# EasyEDA schematic 1-Schematic_BCD to Seven Seg.json
TITLE: Seven Sex Converter; REV: 2; Date: 2022-03-27; Sheet: 1/1; Drawn By: Samuel Raumin; Company: your mom
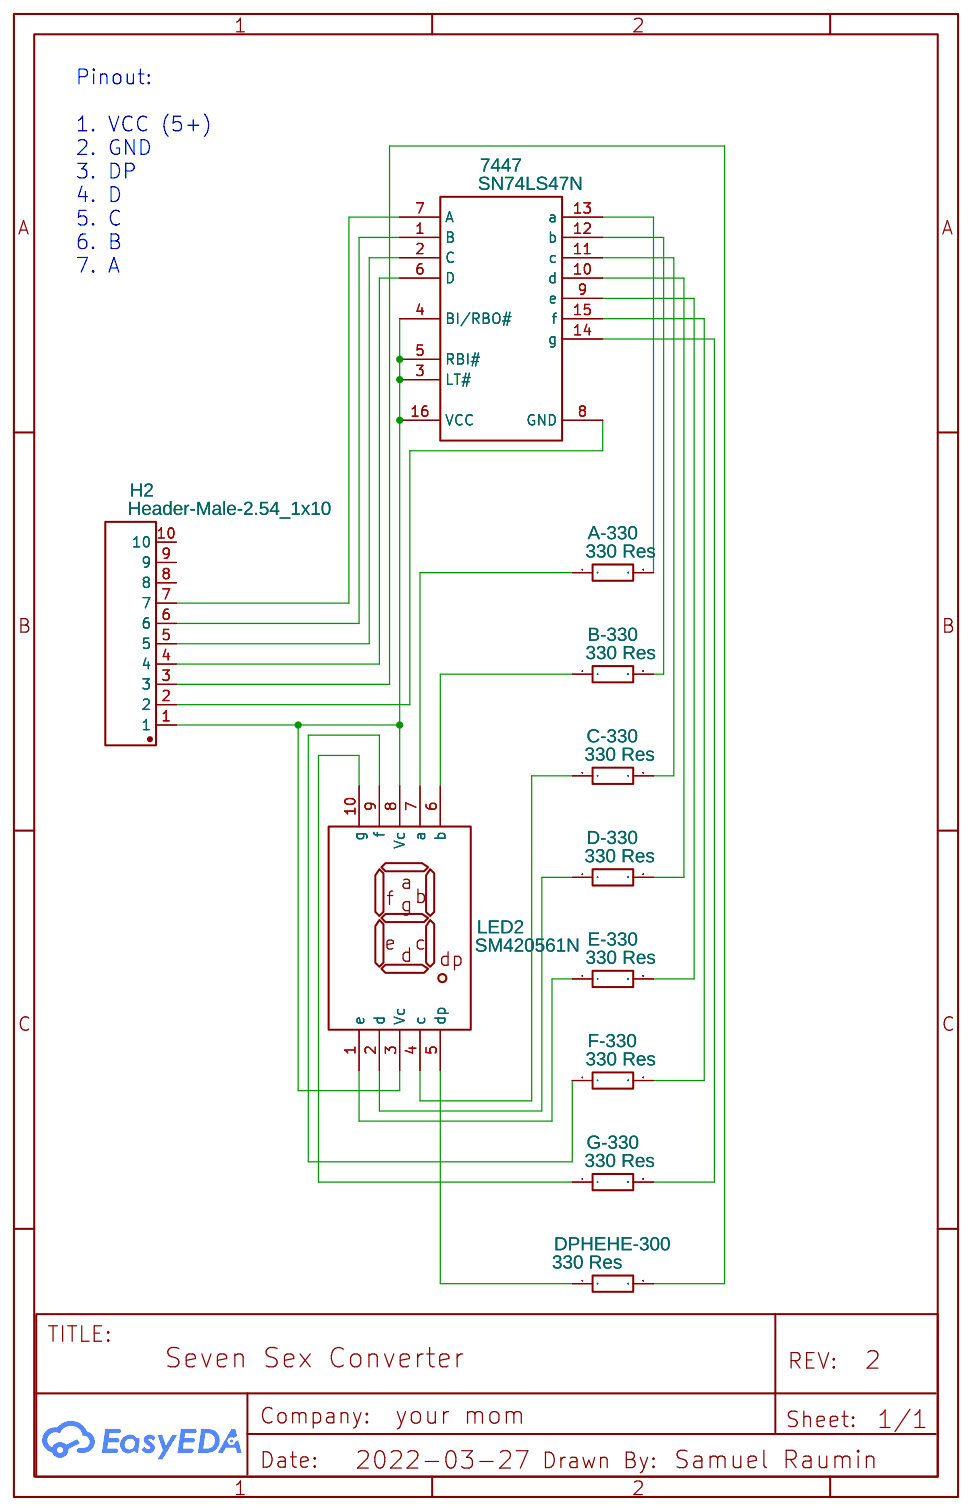
[diagram p0: schematic sheet]

## Parts
7447  SN74LS47N  [DIP-16_L19.3-W6.4-P2.54-LS7.6-BL]
A-330  330 Res  [RES-TH_BD2.5-L6.2-P10.20-D0.6]
B-330  330 Res  [RES-TH_BD2.5-L6.2-P10.20-D0.6]
C-330  330 Res  [RES-TH_BD2.5-L6.2-P10.20-D0.6]
D-330  330 Res  [RES-TH_BD2.5-L6.2-P10.20-D0.6]
DPHEHE-300  330 Res  [RES-TH_BD2.5-L6.2-P10.20-D0.6]
E-330  330 Res  [RES-TH_BD2.5-L6.2-P10.20-D0.6]
F-330  330 Res  [RES-TH_BD2.5-L6.2-P10.20-D0.6]
G-330  330 Res  [RES-TH_BD2.5-L6.2-P10.20-D0.6]
H2  Header-Male-2.54_1x10  [HDR-TH_10P-P2.54-V-M-1]
LED2  SM420561N  [LED-SEG-TH_10P-L12.7-W19.0-P2.54-S15.24-BL]

## Library data of the parts
7447 = SN74LS47N: Supplier: LCSC; Manufacturer: TI; Contributor: LCSC; Supplier Part: C129379; JLCPCB Part Class: Extended Part
A-330 B-330 C-330 D-330 DPHEHE-300 E-330 F-330 G-330 = FR1/4W-10Ω±5%: Supplier: LCSC; Supplier Part: C138368; Manufacturer: Chian Chia Elec; Contributor: LCSC; JLCPCB Part Class: Extended Part; Resistance: 10Ω
H2 = Header-Male-2.54_1x10: Supplier: LCSC; Manufacturer Part: Headers  Pins2.54mm1*10P; Supplier Part: C57369; JLCPCB Part Class: Extended Part
LED2 = SM420561N: Supplier: LCSC; Manufacturer: ARKLED; Contributor: LCSC; Supplier Part: C141367; JLCPCB Part Class: Extended Part

## Nets
Net-(7447-1): 7447.1(B) H2.6
Net-(7447-2): 7447.2(C) H2.5
Net-(7447-3): 7447.3(LT#) 7447.4(BI/RBO#) 7447.5(RBI#) 7447.16(VCC) H2.1 LED2.3(Vc) LED2.8(Vc)
Net-(7447-6): 7447.6(D) H2.4
Net-(7447-7): 7447.7(A) H2.7
Net-(7447-8): 7447.8(GND) H2.2
Net-(7447-9): 7447.9(e) E-330.2
Net-(7447-10): 7447.10(d) D-330.2
Net-(7447-11): 7447.11(c) C-330.2
Net-(7447-12): 7447.12(b) B-330.2
Net-(7447-13): 7447.13(a) A-330.2
Net-(7447-14): 7447.14(g) G-330.2
Net-(7447-15): 7447.15(f) F-330.2
Net-(A-330-1): A-330.1 LED2.7(a)
Net-(B-330-1): B-330.1 LED2.6(b)
Net-(C-330-1): C-330.1 LED2.4(c)
Net-(D-330-1): D-330.1 LED2.2(d)
Net-(DPHEHE-300-1): DPHEHE-300.1 LED2.5(dp)
Net-(DPHEHE-300-2): DPHEHE-300.2 H2.3
Net-(E-330-1): E-330.1 LED2.1(e)
Net-(F-330-1): F-330.1 LED2.9(f)
Net-(G-330-1): G-330.1 LED2.10(g)

Not connected (* = marked no-connect by the designer): H2 8 9 10

## Notes on the sheet
- Pinout:
  1. VCC (5+)
  2. GND
  3. DP
  4. D
  5. C
  6. B
  7. A
